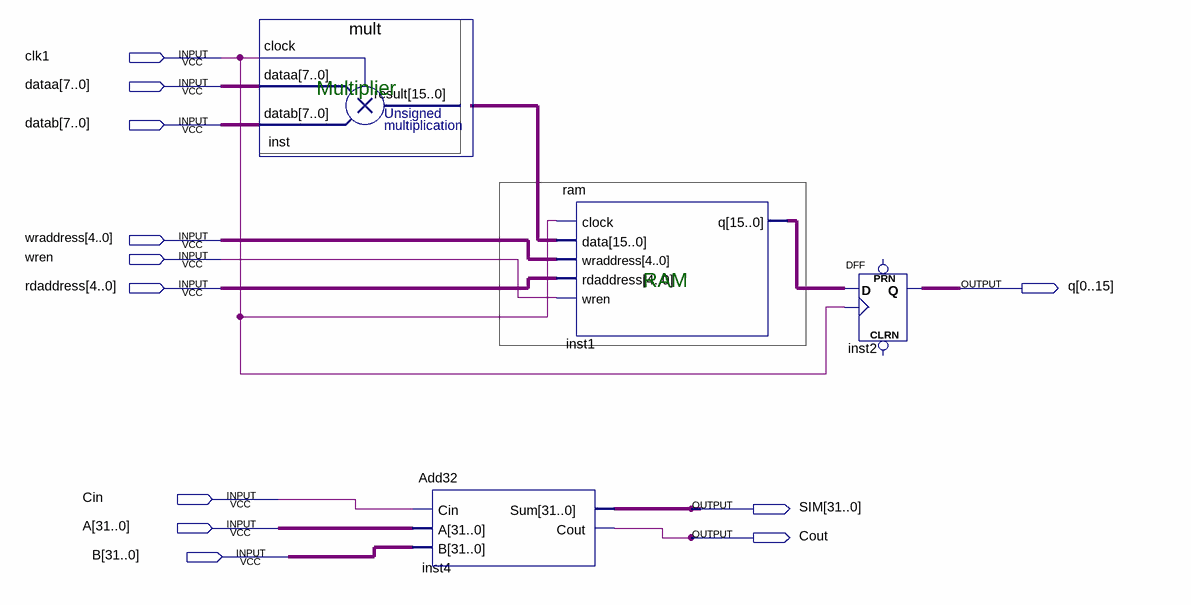
[diagram p0: schematic sheet]
// Quartus schematic pipemult.bdf as structural Verilog: 4 symbols, 12 pins
module pipemult (
  input  clk1,
  input  [7:0] dataa,
  input  [7:0] datab,
  input  [4:0] wraddress,
  input  wren,
  input  [4:0] rdaddress,
  input  Cin,
  input  [31:0] A,
  input  [31:0] B,
  output [0:15] q,
  output [31:0] SIM,
  output Cout
);

  wire [15:0] inst1_q, inst_result;

  mult inst (.clock(clk1), .dataa(dataa), .datab(datab), .result(inst_result));
  Add32 inst4 (.Cin(Cin), .A(A), .B(B), .Sum(SIM), .Cout(Cout));
  ram inst1 (.clock(clk1), .data(inst_result), .wraddress(wraddress), .rdaddress(rdaddress), .wren(wren), .q(inst1_q));
  DFF inst2[15:0] (.CLK(clk1), .D(inst1_q), .Q(q));  // open: CLRN, PRN

  // Notes on the sheet:
  //   Multiplier
  //   RAM
endmodule
